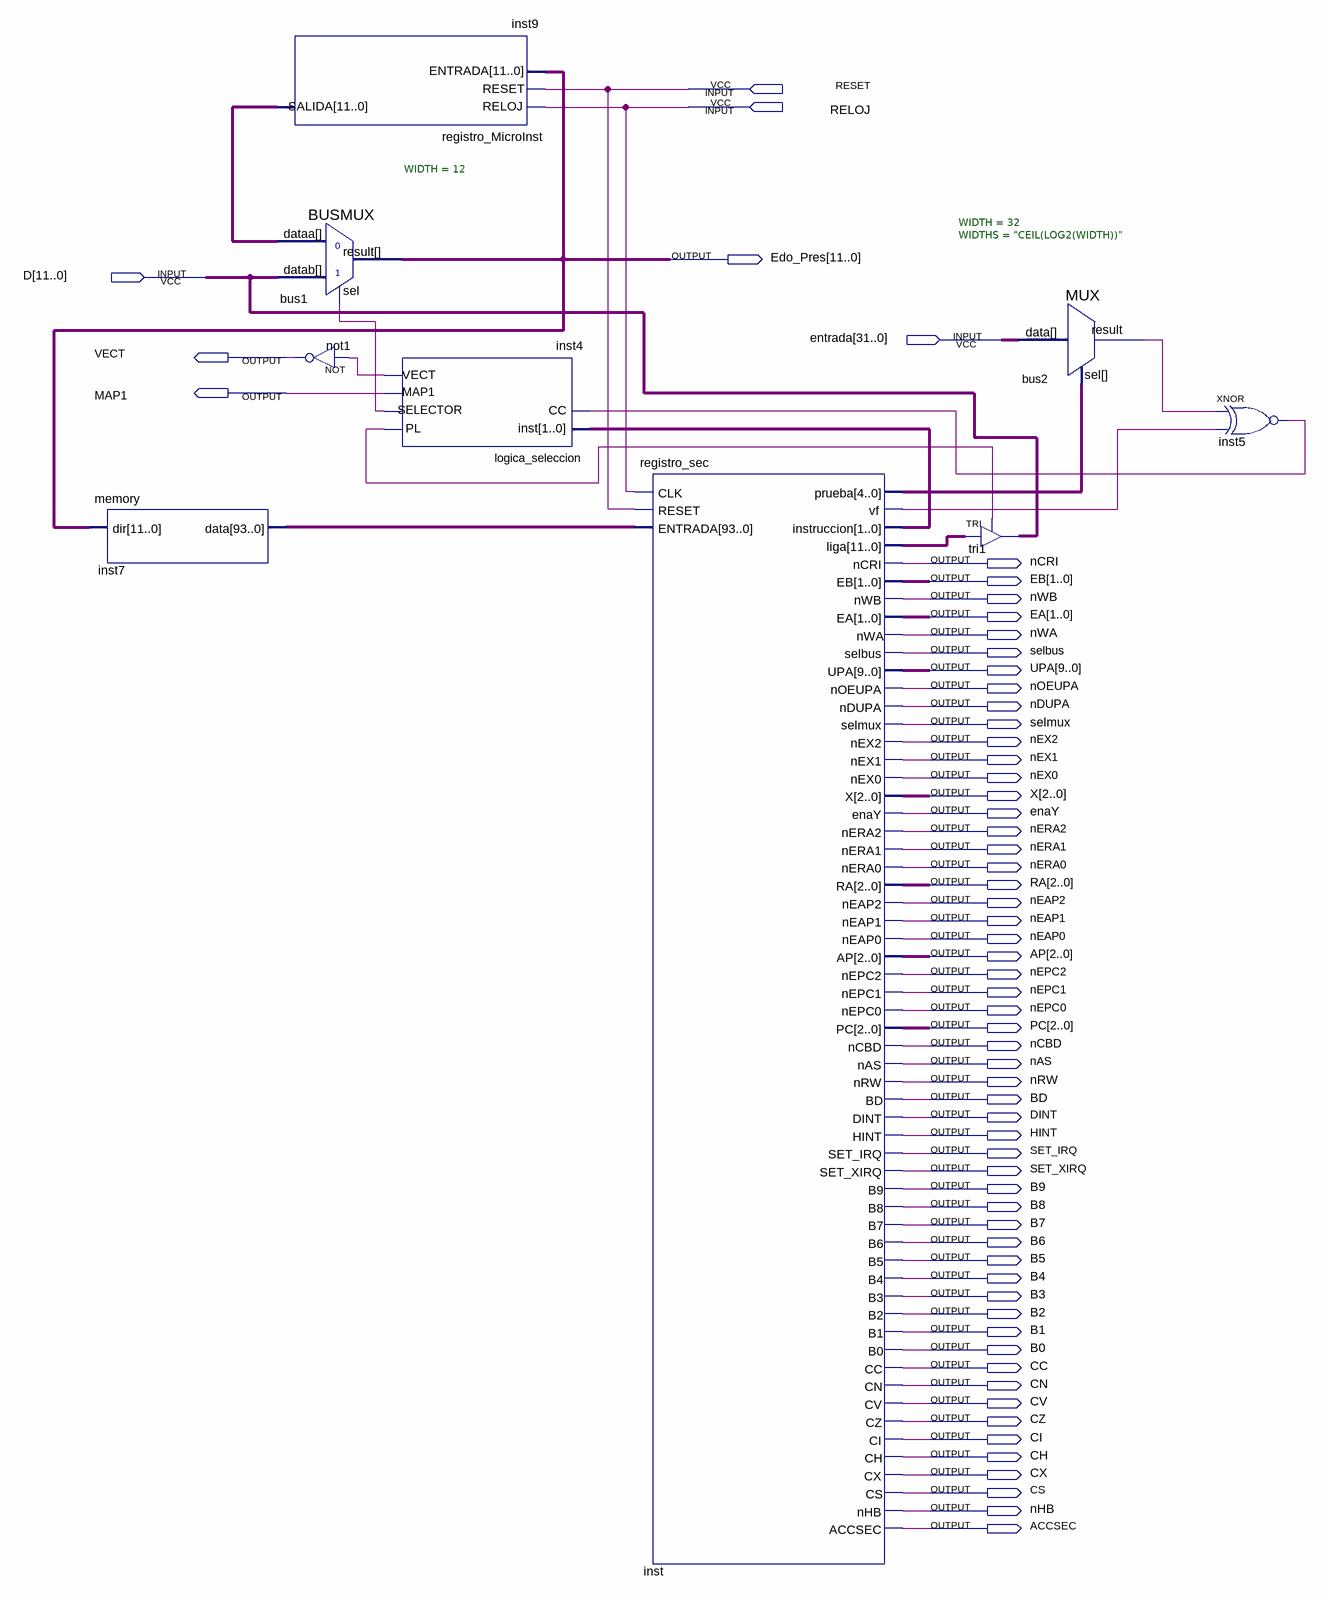
[diagram p0: schematic sheet]
// Quartus schematic secuenciador.bdf as structural Verilog: 9 symbols, 62 pins
module secuenciador (
  input  RESET,
  input  RELOJ,
  input  [11:0] D,
  input  [31:0] entrada,
  output [11:0] Edo_Pres,
  output VECT,
  output MAP1,
  output nCRI,
  output [1:0] EB,
  output nWB,
  output [1:0] EA,
  output nWA,
  output selbus,
  output [9:0] UPA,
  output nOEUPA,
  output nDUPA,
  output selmux,
  output nEX2,
  output nEX1,
  output nEX0,
  output [2:0] X,
  output enaY,
  output nERA2,
  output nERA1,
  output nERA0,
  output [2:0] RA,
  output nEAP2,
  output nEAP1,
  output nEAP0,
  output [2:0] AP,
  output nEPC2,
  output nEPC1,
  output nEPC0,
  output [2:0] PC,
  output nCBD,
  output nAS,
  output nRW,
  output BD,
  output DINT,
  output HINT,
  output SET_IRQ,
  output SET_XIRQ,
  output B9,
  output B8,
  output B7,
  output B6,
  output B5,
  output B4,
  output B3,
  output B2,
  output B1,
  output B0,
  output CC,
  output CN,
  output CV,
  output CZ,
  output CI,
  output CH,
  output CX,
  output CS,
  output nHB,
  output ACCSEC
);

  wire bus2_result, inst4_pl, inst4_selector, inst4_vect, inst5_out, inst_vf;
  wire [1:0] inst_instruccion;
  wire [4:0] inst_prueba;
  wire [11:0] inst9_salida, inst_liga;
  wire [93:0] inst7_data;

  memory inst7 (.dir(Edo_Pres), .data(inst7_data));
  registro_MicroInst inst9 (.RELOJ(RELOJ), .RESET(RESET), .ENTRADA(Edo_Pres), .SALIDA(inst9_salida));
  BUSMUX #(.WIDTH(12)) bus1 (.datab(D), .sel(inst4_selector), .dataa(inst9_salida), .result(Edo_Pres));
  not not1 (VECT, inst4_vect);
  logica_seleccion inst4 (
    .inst(inst_instruccion), .CC(inst5_out), .PL(inst4_pl), .SELECTOR(inst4_selector), .MAP1(MAP1),
    .VECT(inst4_vect));
  registro_sec inst (
    .CLK(RELOJ), .RESET(RESET), .ENTRADA(inst7_data), .prueba(inst_prueba), .vf(inst_vf),
    .instruccion(inst_instruccion), .liga(inst_liga), .nCRI(nCRI), .EB(EB), .nWB(nWB), .EA(EA), .nWA(nWA),
    .selbus(selbus), .UPA(UPA), .nOEUPA(nOEUPA), .nDUPA(nDUPA), .selmux(selmux), .nEX2(nEX2), .nEX1(nEX1),
    .nEX0(nEX0), .X(X), .enaY(enaY), .nERA2(nERA2), .nERA1(nERA1), .nERA0(nERA0), .RA(RA), .nEAP2(nEAP2),
    .nEAP1(nEAP1), .nEAP0(nEAP0), .AP(AP), .nEPC2(nEPC2), .nEPC1(nEPC1), .nEPC0(nEPC0), .PC(PC), .nCBD(nCBD),
    .nAS(nAS), .nRW(nRW), .BD(BD), .DINT(DINT), .HINT(HINT), .SET_IRQ(SET_IRQ), .SET_XIRQ(SET_XIRQ), .B9(B9),
    .B8(B8), .B7(B7), .B6(B6), .B5(B5), .B4(B4), .B3(B3), .B2(B2), .B1(B1), .B0(B0), .CC(CC), .CN(CN),
    .CV(CV), .CZ(CZ), .CI(CI), .CH(CH), .CX(CX), .CS(CS), .nHB(nHB), .ACCSEC(ACCSEC));
  MUX #(.WIDTH(32), .WIDTHS("CEIL(LOG2(WIDTH))")) bus2 (.data(entrada), .sel(inst_prueba), .result(bus2_result));
  TRI \tri1 [11:0] (.IN(inst_liga), .OE(inst4_pl), .OUT(D));
  xnor inst5 (inst5_out, bus2_result, inst_vf);
endmodule
